# EAGLE board main (EAGLE 6.1), part 1 of 4
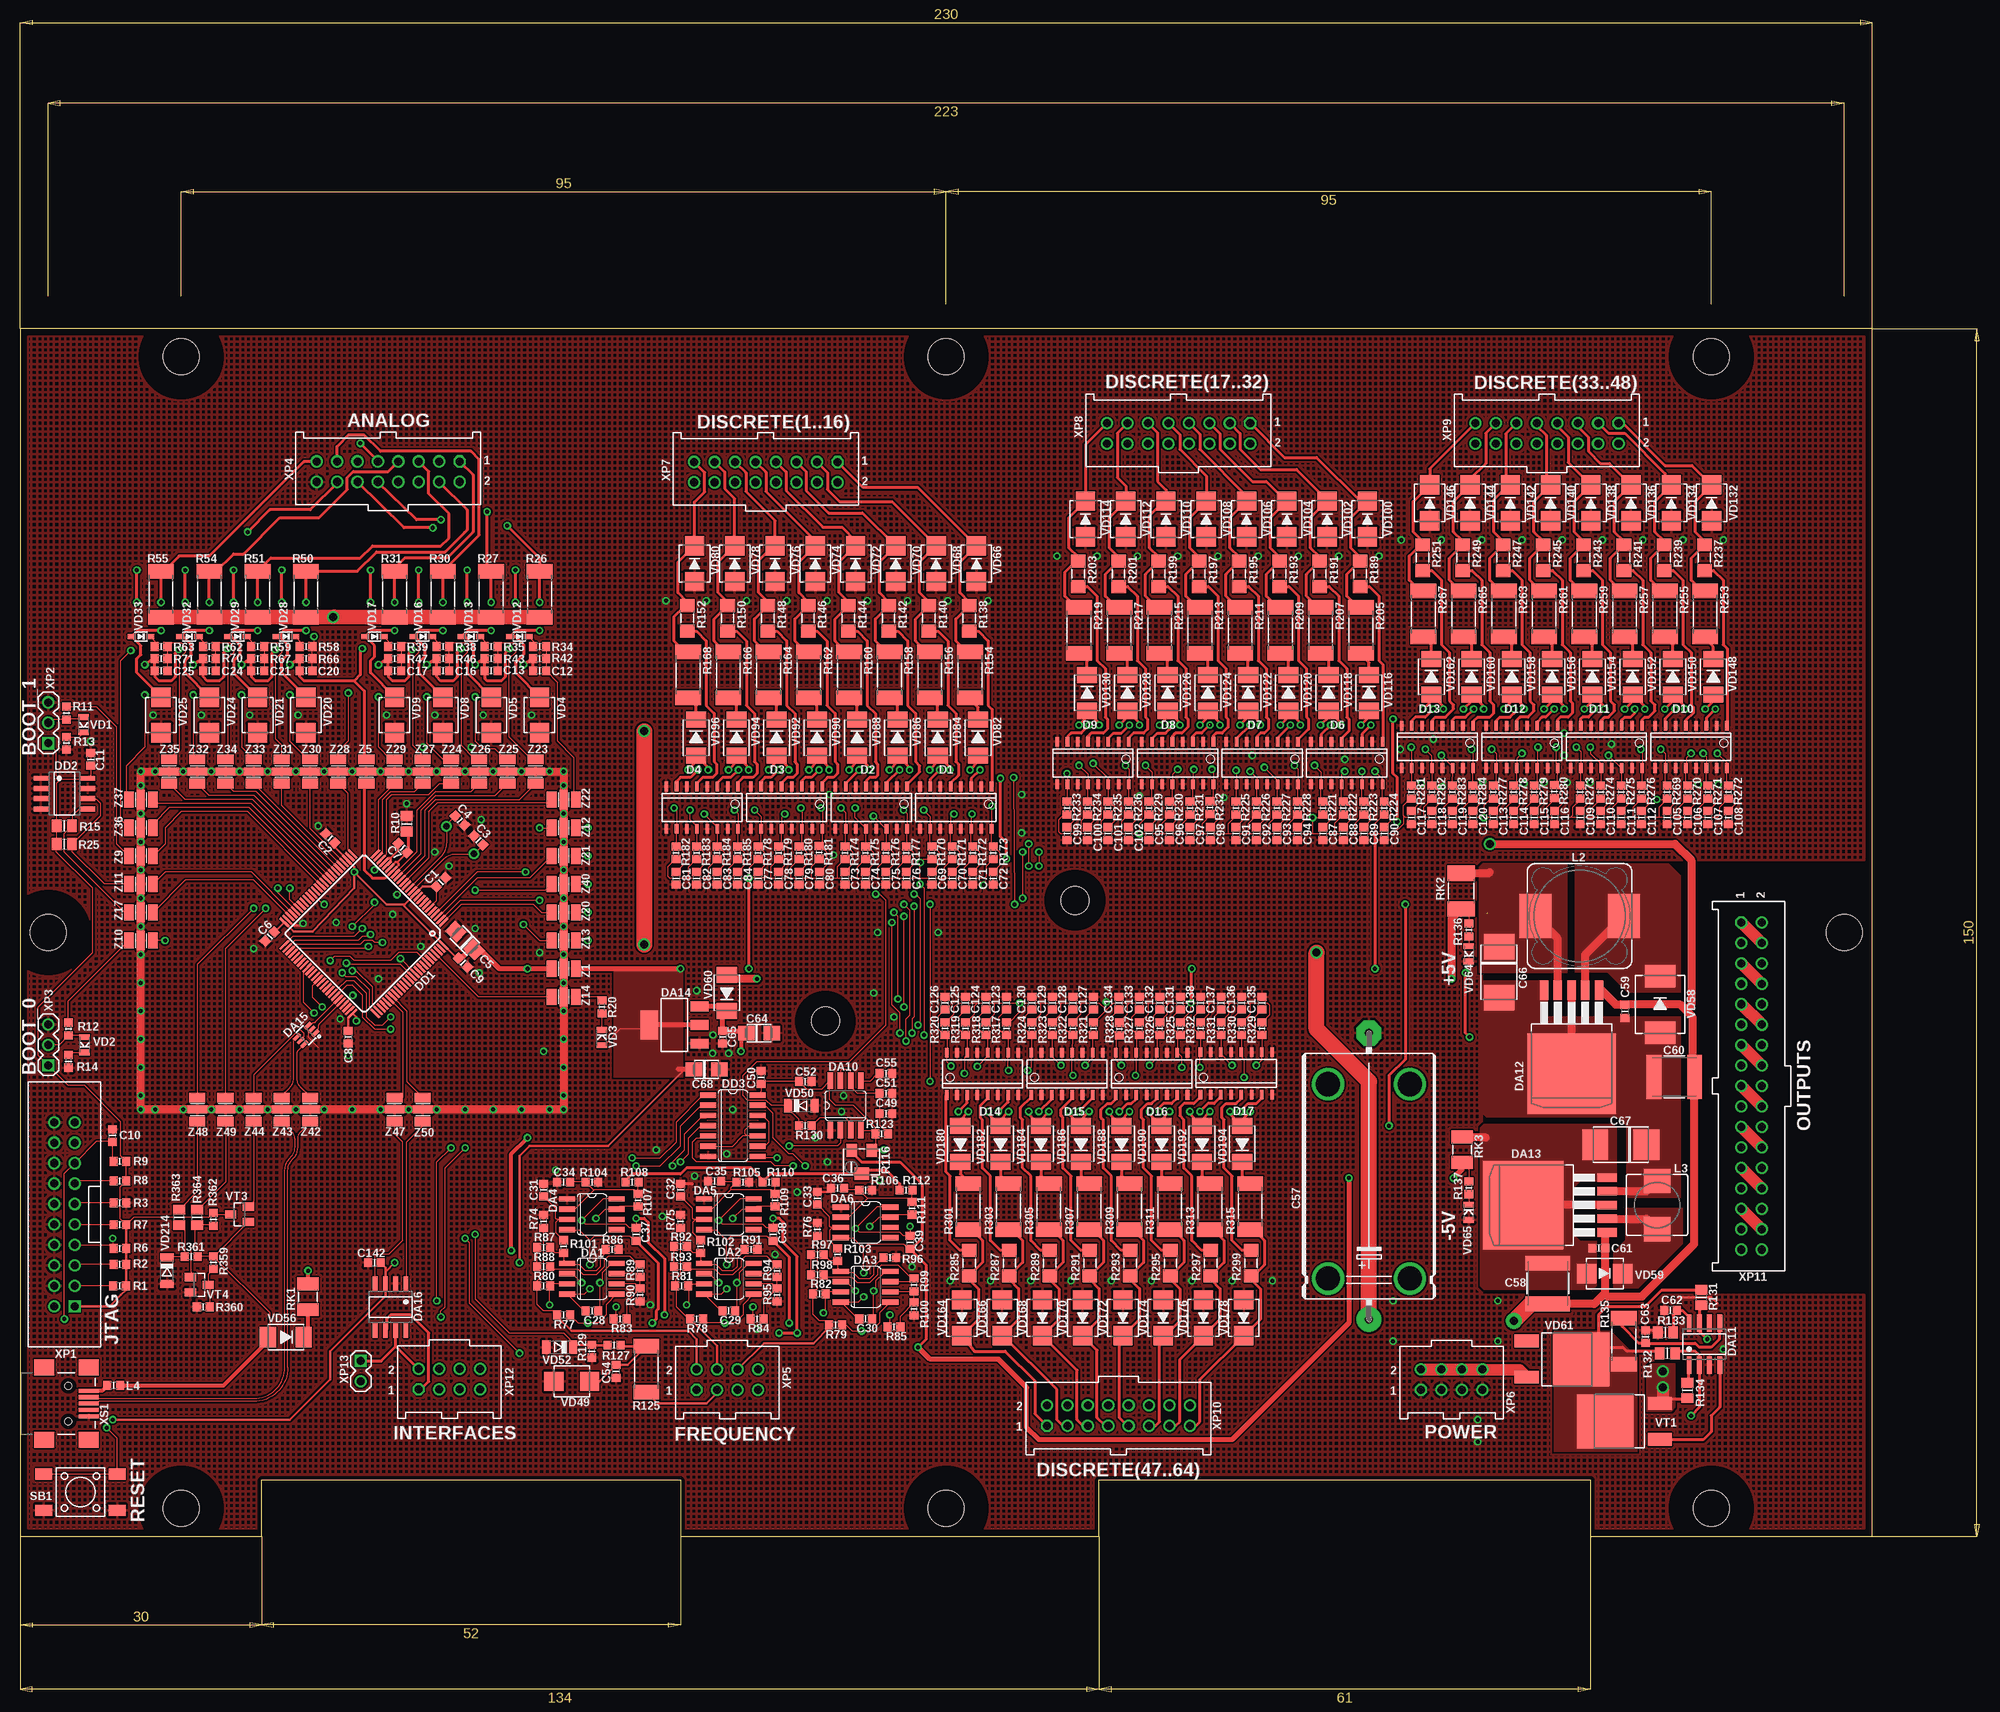
[diagram p11: board, top side]
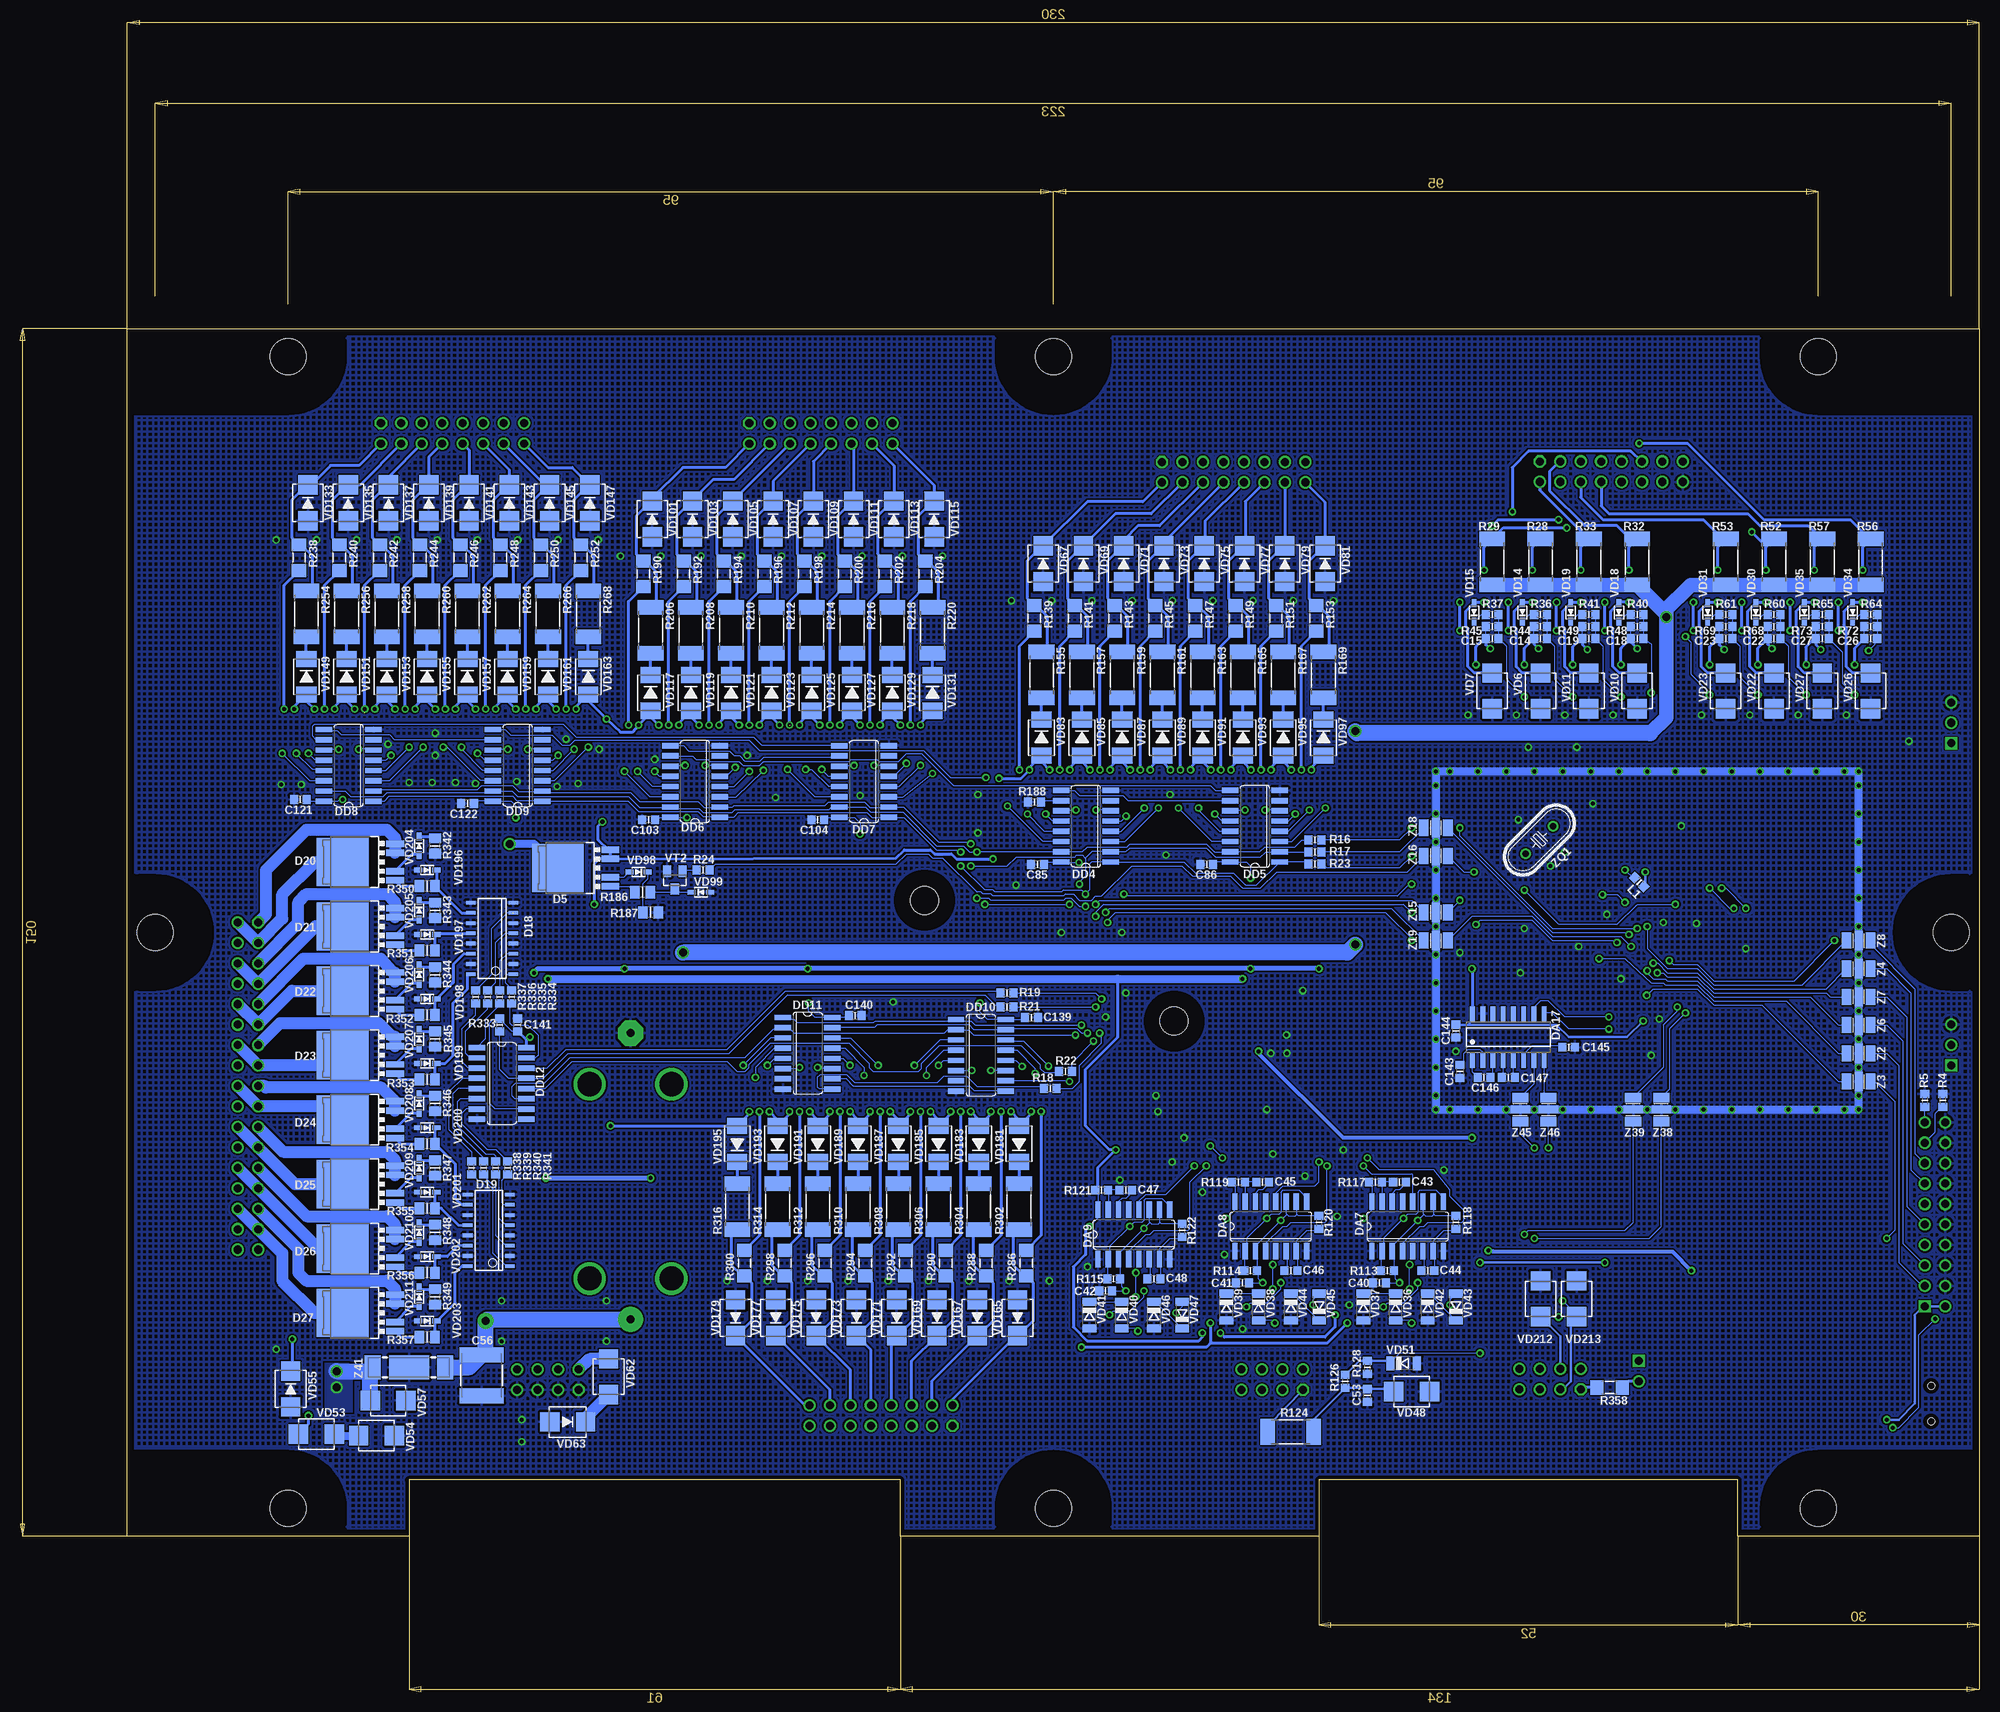
[diagram p12: board, bottom side, seen from below]

Size 230 x 150 mm. Coordinates in mm from the lower left corner, seen from the top.
Outline: 0,0 30,0 30,7 82,7 82,0 134,0 134,7 195,7 195,0 230,0 230,150 0,150 0,0
Copper layers (1*16): Top 0.035mm / dielectric 1.5mm / Bottom 0.035mm
Design rules: minimum track width 0.15mm, minimum drill 0.3mm, track to track 0.15mm, track to pad 0.15mm, pad to pad 0.15mm, via to via 0.15mm, smd to smd 0.15mm, copper to edge 0.5mm, drill to drill 0.3mm, minimum pad ring 10mil, minimum via ring 8mil, stop-mask expansion 0.05mm, vias tented up to drill 0.5mm, thermal gap 0.3mm
bRestrict: 48 lines

## Footprints (pad centres in the part's own frame; a part is rotated, then mirrored left to right if it is on the bottom)
C0603 = smd 1 x 1.1: 1 -0.794,0; 2 0.794,0
A/3216-18W = smd 2.032 x 1.778: + 1.587,0; - -1.587,0
C2220K = smd 1.85 x 5.5: 1 -2.54,0; 2 2.54,0
E35-16-STRAPPED = drill 1 pad 3.15: + -17.78,0 | drill 1 pad 3.15 octagon: - 17.78,0 | drill 3: P$1 -12.7,5.08; P$2 -12.7,-5.08; P$3 11.43,-5.08; P$4 11.43,5.08
TE-D-7343 = smd 3.175 x 3.81: + 3.175,0; - -3.175,0
SO16 = smd 0.45 x 1.2: 1 -4.381,-2.631; 2 -3.111,-2.631; 3 -1.841,-2.631; 4 -0.572,-2.631; 5 0.699,-2.631; 6 1.968,-2.631; 7 3.239,-2.631; 8 4.508,-2.631; 9 4.508,2.631; 10 3.239,2.631; 11 1.968,2.631; 12 0.699,2.631; 13 -0.572,2.631; 14 -1.841,2.631; 15 -3.111,2.631; 16 -4.381,2.631
TO252-5-11 = smd 0.8 x 2.2: 1 -2.28,-5.01; 2 -1.14,-5.01; 4 1.14,-5.01; 5 2.28,-5.01 | smd 6 x 6.4: TAB 0,1.5
SO08 = smd 0.66 x 2.032: 1 -1.905,-3.073; 2 -0.635,-3.073; 3 0.635,-3.073; 4 1.905,-3.073; 5 1.905,3.073; 6 0.635,3.073; 7 -0.635,3.073; 8 -1.905,3.073
SO16' = smd 0.66 x 2.032: 1 -4.445,-3.073; 2 -3.175,-3.073; 3 -1.905,-3.073; 4 -0.635,-3.073; 5 0.635,-3.073; 6 1.905,-3.073; 7 3.175,-3.073; 8 4.445,-3.073; 9 4.445,3.073; 10 3.175,3.073; 11 1.905,3.073; 12 0.635,3.073; 13 -0.635,3.073; 14 -1.905,3.073; 15 -3.175,3.073; 16 -4.445,3.073
SO08' = smd 0.6 x 2.2: 1 -1.905,-2.6; 2 -0.635,-2.6; 3 0.635,-2.6; 4 1.905,-2.6; 5 1.905,2.6; 6 0.635,2.6; 7 -0.635,2.6; 8 -1.905,2.6
TO263-5 = smd 1.067 x 2.413: 1 -3.404,-8.791; 2 -1.702,-8.791; 3 0,-8.791; 4 1.702,-8.791; 5 3.404,-8.791 | smd 11 x 10: 6 0,1.61
SOT223 = smd 1.219 x 2.235: 1 -2.311,-3.099; 2 0,-3.099; 3 2.311,-3.099 | smd 3.6 x 2.2: 4 0,3.099
SOTT323-6L = smd 1.05 x 0.4: 1 -1,0.65; 2 -1,0; 3 -1,-0.65; 4 0.95,-0.65; 5 0.95,0; 6 0.95,0.65
SO08'' = smd 0.6 x 1.8: 1 -1.905,-2.917; 2 -0.635,-2.917; 3 0.635,-2.917; 4 1.905,-2.917; 5 1.905,2.917; 6 0.635,2.917; 7 -0.635,2.917; 8 -1.905,2.917
SO16'' = smd 0.6 x 1.8: 1 -4.445,-2.917; 2 -3.175,-2.917; 3 -1.905,-2.917; 4 -0.635,-2.917; 5 0.635,-2.917; 6 1.905,-2.917; 7 3.175,-2.917; 8 4.445,-2.917; 9 4.445,2.917; 10 3.175,2.917; 11 1.905,2.917; 12 0.635,2.917; 13 -0.635,2.917; 14 -1.905,2.917; 15 -3.175,2.917; 16 -4.445,2.917
TQFP100 = smd 1.5 x 0.3: 1 -8,6; 2 -8,5.5; 3 -8,5; 4 -8,4.5; 5 -8,4; 6 -8,3.5; 7 -8,3; 8 -8,2.5; 9 -8,2; 10 -8,1.5; 11 -8,1; 12 -8,0.5; 13 -8,0; 14 -8,-0.5; 15 -8,-1; 16 -8,-1.5; 17 -8,-2; 18 -8,-2.5; 19 -8,-3; 20 -8,-3.5; 21 -8,-4; 22 -8,-4.5; 23 -8,-5; 24 -8,-5.5; 25 -8,-6; 51 8,-6; 52 8,-5.5; 53 8,-5; 54 8,-4.5; 55 8,-4; 56 8,-3.5; 57 8,-3; 58 8,-2.5; 59 8,-2; 60 8,-1.5; 61 8,-1; 62 8,-0.5; 63 8,0; 64 8,0.5; 65 8,1; 66 8,1.5; 67 8,2; 68 8,2.5; 69 8,3; 70 8,3.5; 71 8,4; 72 8,4.5; 73 8,5; 74 8,5.5; 75 8,6 | smd 0.3 x 1.5: 26 -6,-8; 27 -5.5,-8; 28 -5,-8; 29 -4.5,-8; 30 -4,-8; 31 -3.5,-8; 32 -3,-8; 33 -2.5,-8; 34 -2,-8; 35 -1.5,-8; 36 -1,-8; 37 -0.5,-8; 38 0,-8; 39 0.5,-8; 40 1,-8; 41 1.5,-8; 42 2,-8; 43 2.5,-8; 44 3,-8; 45 3.5,-8; 46 4,-8; 47 4.5,-8; 48 5,-8; 49 5.5,-8; 50 6,-8; 76 6,8; 77 5.5,8; 78 5,8; 79 4.5,8; 80 4,8; 81 3.5,8; 82 3,8; 83 2.5,8; 84 2,8; 85 1.5,8; 86 1,8; 87 0.5,8; 88 0,8; 89 -0.5,8; 90 -1,8; 91 -1.5,8; 92 -2,8; 93 -2.5,8; 94 -3,8; 95 -3.5,8; 96 -4,8; 97 -4.5,8; 98 -5,8; 99 -5.5,8; 100 -6,8
SO14 = smd 0.66 x 2.032: 1 -3.81,-3.073; 2 -2.54,-3.073; 3 -1.27,-3.073; 4 0,-3.073; 5 1.27,-3.073; 6 2.54,-3.073; 7 3.81,-3.073; 8 3.81,3.073; 9 2.54,3.073; 10 1.27,3.073; 11 0,3.073; 12 -1.27,3.073; 13 -2.54,3.073; 14 -3.81,3.073
STAND-OFF-M4 = hole 4.5: 0,0
STAND-OFF-M3 = hole 3.5: 0,0
L0603 = smd 1 x 1.1: 1 -0.794,0; 2 0.794,0
DRA127 = smd 4 x 5.5: 1 -5.5,0; 2 5.5,0
DRA73 = smd 3 x 3.25: 1 -3,0; 2 3,0
R0603 = smd 1 x 1.1: 1 -0.794,0; 2 0.794,0
R0805 = smd 1.2 x 1.5: 1 -0.953,0; 2 0.953,0
R2512 = smd 1.8 x 3.2: 1 -2.857,0; 2 2.857,0
RTRIMTSM53YJ = smd 1.3 x 1.6: 1 -1.25,-1.45; 3 1.25,-1.45 | smd 1.8 x 1.6: 2 0,1.45
R1206 = smd 1.6 x 1.803: 1 -1.587,0; 2 1.587,0
RK1210 = smd 1.6 x 2.7: 1 -1.587,0; 2 1.587,0
RK1812 = smd 1.9 x 3.4: 1 -2.223,0; 2 2.223,0
B3S-10XX = smd 2.1 x 1.4: 1 -4.55,2.25; 2 4.55,2.25; 3 -4.55,-2.25; 4 4.55,-2.25
LED-0805 = smd 0.7 x 1.3: A -1,0; C 0.9,0
SMB-BIDIR = smd 2.4 x 2.4: A1 -2.223,0; A2 2.223,0
SOD323 = smd 1 x 0.6: A 1.143,0; C -1.143,0
SOD80 = smd 1 x 1.7: A 1.65,0; C -1.65,0
SMB = smd 2.4 x 2.4: A 2.223,0; C -2.223,0
SMA = smd 2 x 2.5: A 2.223,0; C -2.223,0
SMC = smd 2.8 x 3.8: A 3.493,0; C -3.493,0
DPAK = smd 1.6 x 2.997: 1 -2.261,-4.928; 3 2.21,-4.928 | smd 6.7 x 7: 2 0,1.853
SOT23-BEC = smd 1 x 1.4: B -0.95,-1.1; C 0,1.1; E 0.95,-1.1
PLD_2X10_SHROUDED = drill 1 square: 1 -1.27,11.43 | drill 1: 2 1.27,11.43; 3 -1.27,8.89; 4 1.27,8.89; 5 -1.27,6.35; 6 1.27,6.35; 7 -1.27,3.81; 8 1.27,3.81; 9 -1.27,1.27; 10 1.27,1.27; 11 -1.27,-1.27; 12 1.27,-1.27; 13 -1.27,-3.81; 14 1.27,-3.81; 15 -1.27,-6.35; 16 1.27,-6.35; 17 -1.27,-8.89; 18 1.27,-8.89; 19 -1.27,-11.43; 20 1.27,-11.43
PLD_1X03 = drill 1 square: 1 0,0 | drill 1: 2 2.54,0; 3 5.08,0
MOLEX-90130-16 = drill 1 octagon: 1 0,0 | drill 1: 2 0,2.54; 3 2.54,0; 4 2.54,2.54; 5 5.08,0; 6 5.08,2.54; 7 7.62,0; 8 7.62,2.54; 9 10.16,0; 10 10.16,2.54; 11 12.7,0; 12 12.7,2.54; 13 15.24,0; 14 15.24,2.54; 15 17.78,0; 16 17.78,2.54
MOLEX-90130-08 = drill 1 octagon: 1 0,0 | drill 1: 2 0,2.54; 3 2.54,0; 4 2.54,2.54; 5 5.08,0; 6 5.08,2.54; 7 7.62,0; 8 7.62,2.54
MOLEX-90130-34 = drill 1 octagon: 1 0,0 | drill 1: 2 0,2.54; 3 2.54,0; 4 2.54,2.54; 5 5.08,0; 6 5.08,2.54; 7 7.62,0; 8 7.62,2.54; 9 10.16,0; 10 10.16,2.54; 11 12.7,0; 12 12.7,2.54; 13 15.24,0; 14 15.24,2.54; 15 17.78,0; 16 17.78,2.54; 17 20.32,0; 18 20.32,2.54; 19 22.86,0; 20 22.86,2.54; 21 25.4,0; 22 25.4,2.54; 23 27.94,0; 24 27.94,2.54; 25 30.48,0; 26 30.48,2.54; 27 33.02,0; 28 33.02,2.54; 29 35.56,0; 30 35.56,2.54; 31 38.1,0; 32 38.1,2.54; 33 40.64,0; 34 40.64,2.54
PLD_1X02 = drill 1 square: 1 0,0 | drill 1: 2 2.54,0
USB-MINIB = smd 2.5 x 0.5: D+ 2.5,0; D- 2.5,0.8; GND 2.5,-1.6; ID 2.5,-0.8; VBUS 2.5,1.6 | smd 2.5 x 2: SHIELD1 -3,4.5; SHIELD2 2.5,4.5; SHIELD3 -3,-4.5; SHIELD4 2.5,-4.5 | hole 0.9: 0,2.2; 0,-2.2
NFE31 = smd 1.2 x 2: 1 -1.5,0; 3 1.5,0 | smd 1 x 2.4: 2 0,0
TUSONIX-4701 = smd 2 x 3: 1 -4.5,0; 3 4.5,0 | smd 5 x 3: 2 0,0
HC49U-V = drill 0.8: 1 -2.413,0; 2 2.413,0

## Placement (x,y rotation side)
C1  0.1uF  [C0603]  52.25,81.25 45 top
C2  0.1uF  [C0603]  38.5,86.7 135 top
C3  22pF  [C0603]  56.93,86.43 135 top
C4  22pF  [C0603]  54.61,88.91 315 top
C5  10uF/10V  [A/3216-18W]  55.25,74 315 top
C6  0.1uF  [C0603]  31,74.5 225 top
C7  1uF/16V  [C0603]  47.5,85.5 315 top
C8  0.1uF  [C0603]  40.75,62 270 top
C9  0.1uF  [C0603]  55,71.25 315 top
C10  0.1uF  [C0603]  11.47,49.77 90 top
C11  0.1uF  [C0603]  8.75,96.5 270 top
C12  1uF/16V  [C0603]  64.5,107.5 180 top
C13  1uF/16V  [C0603]  58.5,107.5 180 top
C14  1uF/16V  [C0603]  54.5,111.5 180 bottom
C15  1uF/16V  [C0603]  60.5,111.5 180 bottom
C16  1uF/16V  [C0603]  52.5,107.5 180 top
C17  1uF/16V  [C0603]  46.5,107.5 180 top
C18  1uF/16V  [C0603]  42.5,111.5 180 bottom
C19  1uF/16V  [C0603]  48.5,111.5 180 bottom
C20  1uF/16V  [C0603]  35.5,107.5 180 top
C21  1uF/16V  [C0603]  29.5,107.5 180 top
C22  1uF/16V  [C0603]  25.5,111.5 180 bottom
C23  1uF/16V  [C0603]  31.5,111.5 180 bottom
C24  1uF/16V  [C0603]  23.5,107.5 180 top
C25  1uF/16V  [C0603]  17.5,107.5 180 top
C26  1uF/16V  [C0603]  13.5,111.5 180 bottom
C27  1uF/16V  [C0603]  19.5,111.5 180 bottom
C28  0.1uF  [C0603]  71,28 180 top
C29  0.1uF  [C0603]  88,28 180 top
C30  0.1uF  [C0603]  105,27 180 top
C31  0.1uF  [C0603]  65,43 270 top
C32  0.1uF  [C0603]  82,43 270 top
C33  0.1uF  [C0603]  99,42 270 top
C34  0.1uF  [C0603]  67.5,44 180 top
C35  0.1uF  [C0603]  86.25,44.12 180 top
C36  0.1uF  [C0603]  101.5,43.25 180 top
C37  0.1uF  [C0603]  76.5,37.5 270 top
C38  0.1uF  [C0603]  93.5,37.5 270 top
C39  0.1uF  [C0603]  110.5,36.5 270 top
C40  0.1uF  [C0603]  74.5,31.5 180 bottom
C41  0.1uF  [C0603]  91.5,31.5 180 bottom
C42  0.1uF  [C0603]  108.5,30.5 180 bottom
C43  1000pF  [C0603]  72,44 180 bottom
C44  1000pF  [C0603]  68.5,33 0 bottom
C45  1000pF  [C0603]  89,44 180 bottom
C46  1000pF  [C0603]  85.5,33 0 bottom
C47  1000pF  [C0603]  106,43 180 bottom
C48  1000pF  [C0603]  102.5,32 0 bottom
C49  5600pF  [C0603]  107.5,52.5 0 top
C50  0.1uF  [C0603]  92,57 90 top
C51  5600pF  [C0603]  107.5,55 0 top
C52  0.1uF  [C0603]  97.5,56.5 0 top
C53  0.1uF  [C0603]  76,17.5 90 bottom
C54  0.1uF  [C0603]  74,20.5 90 top
C55  0.1uF  [C0603]  107.5,57.5 0 top
C56  10uF/50V  [C2220K]  186,20 90 bottom
C57  1000uF/50v  [E35-16-STRAPPED]  167.5,44.73 90 top
C58  10uF/50V  [C2220K]  189.7,31.4 270 top
C59  0.1uF  [C0603]  199.28,65.18 270 top
C60  10uF/50V  [C2220K]  205.4,57.05 0 top
C61  0.1uF  [C0603]  196.03,35.8 180 top
C62  0.01uF  [C0603]  204.95,28.07 180 top
C63  0.1uF  [C0603]  201.85,24.81 90 top
C64  10uF/10V  [A/3216-18W]  91.75,62.5 180 top
C65  1uF/16V  [C0603]  87.25,62 270 top
C66  220uF/10V  [TE-D-7343]  183.65,70.05 90 top
C67  220uF/10V  [TE-D-7343]  198.77,48.65 0 top
C68  10uF/10V  [A/3216-18W]  85.25,58 180 top
C69  0.1uF  [C0603]  113.22,81.72 270 top
C70  0.1uF  [C0603]  115.76,81.72 270 top
C71  0.1uF  [C0603]  118.3,81.72 270 top
C72  0.1uF  [C0603]  120.84,81.72 270 top
C73  0.1uF  [C0603]  102.42,81.72 270 top
C74  0.1uF  [C0603]  104.97,81.72 270 top
C75  0.1uF  [C0603]  107.5,81.72 270 top
C76  0.1uF  [C0603]  110.05,81.72 270 top
C77  0.1uF  [C0603]  91.63,81.72 270 top
C78  0.1uF  [C0603]  94.17,81.72 270 top
C79  0.1uF  [C0603]  96.71,81.72 270 top
C80  0.1uF  [C0603]  99.25,81.72 270 top
C81  0.1uF  [C0603]  81.47,81.72 270 top
C82  0.1uF  [C0603]  84.01,81.72 270 top
C83  0.1uF  [C0603]  86.55,81.72 270 top
C84  0.1uF  [C0603]  89.09,81.72 270 top
C85  0.1uF  [C0603]  116.95,83.45 180 bottom
C86  0.1uF  [C0603]  95.95,83.45 180 bottom
C87  0.1uF  [C0603]  161.77,87.28 270 top
C88  0.1uF  [C0603]  164.31,87.28 270 top
C89  0.1uF  [C0603]  166.85,87.28 270 top
C90  0.1uF  [C0603]  169.39,87.28 270 top
C91  0.1uF  [C0603]  150.97,87.28 270 top
C92  0.1uF  [C0603]  153.51,87.28 270 top
C93  0.1uF  [C0603]  156.06,87.28 270 top
C94  0.1uF  [C0603]  158.59,87.28 270 top
C95  0.1uF  [C0603]  140.18,87.28 270 top
C96  0.1uF  [C0603]  142.72,87.28 270 top
C97  0.1uF  [C0603]  145.26,87.28 270 top
C98  0.1uF  [C0603]  147.8,87.28 270 top
C99  0.1uF  [C0603]  130.02,87.28 270 top
C100  0.1uF  [C0603]  132.56,87.28 270 top
C101  0.1uF  [C0603]  135.1,87.28 270 top
C102  0.1uF  [C0603]  137.64,87.28 270 top
C103  0.1uF  [C0603]  165.25,89 180 bottom
C104  0.1uF  [C0603]  144.25,89 180 bottom
C105  0.1uF  [C0603]  204.52,89.28 270 top
C106  0.1uF  [C0603]  207.06,89.28 270 top
C107  0.1uF  [C0603]  209.6,89.28 270 top
C108  0.1uF  [C0603]  212.14,89.28 270 top
C109  0.1uF  [C0603]  193.72,89.28 270 top
C110  0.1uF  [C0603]  196.26,89.28 270 top
C111  0.1uF  [C0603]  198.81,89.28 270 top
C112  0.1uF  [C0603]  201.34,89.28 270 top
C113  0.1uF  [C0603]  182.93,89.28 270 top
C114  0.1uF  [C0603]  185.47,89.28 270 top
C115  0.1uF  [C0603]  188.01,89.28 270 top
C116  0.1uF  [C0603]  190.55,89.28 270 top
C117  0.1uF  [C0603]  172.77,89.28 270 top
C118  0.1uF  [C0603]  175.31,89.28 270 top
C119  0.1uF  [C0603]  177.85,89.28 270 top
C120  0.1uF  [C0603]  180.39,89.28 270 top
C121  0.1uF  [C0603]  208.5,91.5 180 bottom
C122  0.1uF  [C0603]  187.75,91 180 bottom
C123  0.1uF  [C0603]  122.48,66.22 90 top
C124  0.1uF  [C0603]  119.94,66.22 90 top
C125  0.1uF  [C0603]  117.4,66.22 90 top
C126  0.1uF  [C0603]  114.86,66.22 90 top
C127  0.1uF  [C0603]  133.28,66.22 90 top
C128  0.1uF  [C0603]  130.74,66.22 90 top
C129  0.1uF  [C0603]  128.19,66.22 90 top
C130  0.1uF  [C0603]  125.66,66.22 90 top
C131  0.1uF  [C0603]  144.07,66.22 90 top
C132  0.1uF  [C0603]  141.53,66.22 90 top
C133  0.1uF  [C0603]  138.99,66.22 90 top
C134  0.1uF  [C0603]  136.45,66.22 90 top
C135  0.1uF  [C0603]  154.23,66.22 90 top
C136  0.1uF  [C0603]  151.69,66.22 90 top
C137  0.1uF  [C0603]  149.15,66.22 90 top
C138  0.1uF  [C0603]  146.61,66.22 90 top
C139  0.1uF  [C0603]  117.72,64.43 0 bottom
C140  0.1uF  [C0603]  139.59,64.69 0 bottom
C141  0.1uF  [C0603]  181.5,63.5 90 bottom
C142  0.1uF  [C0603]  44,34 0 top
C143  0.1uF  [C0603]  64.5,57.75 270 bottom
C144  0.1uF  [C0603]  65,62.75 270 bottom
C145  0.1uF  [C0603]  51,60.75 0 bottom
C146  0.1uF  [C0603]  61.5,57 0 bottom
C147  0.1uF  [C0603]  58.5,57 0 bottom
D1  TCMT4100  [SO16]  116.25,90.5 180 top
D2  TCMT4100  [SO16]  105.75,90.5 180 top
D3  TCMT4100  [SO16]  95.25,90.5 180 top
D4  TCMT4100  [SO16]  84.75,90.5 180 top
D5  AUIPS7111S  [TO252-5-11]  175,83 90 bottom
D6  TCMT4100  [SO16]  164.8,96.05 180 top
D7  TCMT4100  [SO16]  154.3,96.05 180 top
D8  TCMT4100  [SO16]  143.8,96.05 180 top
D9  TCMT4100  [SO16]  133.3,96.05 180 top
D10  TCMT4100  [SO16]  207.55,98.05 180 top
D11  TCMT4100  [SO16]  197.05,98.05 180 top
D12  TCMT4100  [SO16]  186.55,98.05 180 top
D13  TCMT4100  [SO16]  176.05,98.05 180 top
D14  TCMT4100  [SO16]  119.45,57.45 0 top
D15  TCMT4100  [SO16]  129.95,57.45 0 top
D16  TCMT4100  [SO16]  140.45,57.45 0 top
D17  TCMT4100  [SO16]  150.95,57.5 0 top
D18  TCMT4100  [SO16]  184.7,74.2 90 bottom
D19  TCMT4100  [SO16]  185.1,37.95 90 bottom
D20  AUIPS7111S  [TO252-5-11]  201.75,83.75 90 bottom
D21  AUIPS7111S  [TO252-5-11]  201.75,75.75 90 bottom
D22  AUIPS7111S  [TO252-5-11]  201.75,67.75 90 bottom
D23  AUIPS7111S  [TO252-5-11]  201.75,59.75 90 bottom
D24  AUIPS7111S  [TO252-5-11]  201.75,51.75 90 bottom
D25  AUIPS7111S  [TO252-5-11]  201.75,43.75 90 bottom
D26  AUIPS7111S  [TO252-5-11]  201.75,35.75 90 bottom
D27  AUIPS7111S  [TO252-5-11]  201.75,27.75 90 bottom
DA1  LM2904M  [SO08]  71,32 270 top
DA2  LM2904M  [SO08]  88,32 270 top
DA3  LM2904M  [SO08]  105,31 270 top
DA4  IL311AD  [SO08]  71,40 270 top
DA5  IL311AD  [SO08]  88,40 270 top
DA6  IL311AD  [SO08]  105,39 270 top
DA7  74HC123D  [SO16']  71,38.5 0 bottom
DA8  74HC123D  [SO16']  88,38.5 0 bottom
DA9  74HC123D  [SO16']  105,37.5 0 bottom
DA10  SA555D  [SO08]  102.5,53.5 0 top
DA11  MC33091A  [SO08']  209.15,23.89 0 top
DA12  LM2596S-5.0  [TO263-5]  192.65,59.05 180 top
DA13  LM2596S-5.0  [TO263-5]  188.27,41.15 90 top
DA14  IL5233G  [SOT223]  81.25,63.5 90 top
DA15  USBUF01W6  [SOTT323-6L]  35.5,62.25 225 top
DA16  SN65HVD232  [SO08'']  46,28.5 180 top
DA17  ILX3232D  [SO16'']  58.5,62 0 bottom
DD1  STM32F103VDT6  [TQFP100]  42.71,74.85 225 top
DD2  IN24AA32AD  [SO08'']  5.5,92.25 270 top
DD3  74HC11D  [SO14]  88.5,51 270 top
DD4  74HC165D  [SO16']  110.95,88.2 90 bottom
DD5  74HC165D  [SO16']  89.95,88.2 90 bottom
DD6  74HC165D  [SO16']  159.5,93.75 90 bottom
DD7  74HC165D  [SO16']  138.5,93.75 90 bottom
DD8  74HC165D  [SO16']  202.5,95.75 90 bottom
DD9  74HC165D  [SO16']  181.5,95.75 90 bottom
DD10  74HC165D  [SO16']  124,59.75 270 bottom
DD11  74HC165D  [SO16']  145.5,60 270 bottom
DD12  74HC595D  [SO16']  183.5,56.25 270 bottom
JP1  STAND-OFF-M4  [STAND-OFF-M4]  20,146.5 0 top
JP2  STAND-OFF-M4  [STAND-OFF-M4]  210,146.5 0 top
JP3  STAND-OFF-M4  [STAND-OFF-M4]  115,146.5 0 top
JP4  STAND-OFF-M4  [STAND-OFF-M4]  226.5,75 0 top
JP5  STAND-OFF-M4  [STAND-OFF-M4]  3.5,75 0 top
JP6  STAND-OFF-M4  [STAND-OFF-M4]  210,3.5 0 top
JP7  STAND-OFF-M4  [STAND-OFF-M4]  115,3.5 0 top
JP8  STAND-OFF-M4  [STAND-OFF-M4]  20,3.5 0 top
JP9  STAND-OFF-M3  [STAND-OFF-M3]  131,79 0 top
JP10  STAND-OFF-M3  [STAND-OFF-M3]  100,64 0 top
L1  EXC3BP  [L0603]  42.25,81.25 135 bottom
L2  47uH  [DRA127]  193.65,77.05 180 top
L3  100uH  [DRA73]  203.27,41.15 90 top
L4  EXC3BP  [L0603]  11.63,18.75 0 top
R1  10kOhm/1%  [R0603]  12.35,31.11 0 top
R2  10kOhm/1%  [R0603]  12.39,33.79 0 top
R3  10kOhm/1%  [R0603]  12.39,41.42 0 top
R4  10kOhm/1%  [R0603]  4.55,54.14 90 bottom
R5  10kOhm/1%  [R0603]  6.76,54.14 90 bottom
R6  10kOhm/1%  [R0603]  12.39,35.75 0 top
R7  10kOhm/1%  [R0603]  12.39,38.71 0 top
R8  10kOhm/1%  [R0603]  12.39,44.13 0 top
R9  10kOhm/1%  [R0603]  12.39,46.59 0 top
R10  0Ohm  [R0805]  48,88.5 270 top
R11  100kOhm/1%  [R0603]  5.75,102.25 270 top
R12  100kOhm/1%  [R0603]  6,63 270 top
R13  330Ohm/5%  [R0603]  5.75,98.5 90 top
R14  330Ohm/5%  [R0603]  6,59 90 top
R15  1kOhm/5%  [R0805]  5.5,88.25 0 top
R16  100Ohm/5%  [R0603]  82.5,86.5 0 bottom
R17  100Ohm/5%  [R0603]  82.5,85 0 bottom
R18  100Ohm/5%  [R0603]  115.38,55.62 0 bottom
R19  100Ohm/5%  [R0603]  120.75,67.5 0 bottom
R20  330Ohm/5%  [R0603]  72.25,65.75 270 top
R21  100Ohm/5%  [R0603]  120.75,65.75 0 bottom
R22  100Ohm/5%  [R0603]  113.5,57.75 0 bottom
R23  100Ohm/5%  [R0603]  82.5,83.5 0 bottom
R24  100Ohm/5%  [R0603]  158.5,82.75 0 bottom
R25  1kOhm/5%  [R0805]  5.5,86 0 top
R26  1kOhm/1%  [R2512]  64.5,117 90 top
R27  1kOhm/1%  [R2512]  58.5,117 90 top
R28  1kOhm/1%  [R2512]  54.5,121 90 bottom
R29  1kOhm/1%  [R2512]  60.5,121 90 bottom
R30  1kOhm/1%  [R2512]  52.5,117 90 top
R31  1kOhm/1%  [R2512]  46.5,117 90 top
R32  1kOhm/1%  [R2512]  42.5,121 90 bottom
R33  1kOhm/1%  [R2512]  48.5,121 90 bottom
R34  100kOhm/1%  [R0603]  64.5,110.5 0 top
R35  100kOhm/1%  [R0603]  58.5,110.5 0 top
R36  100kOhm/1%  [R0603]  54.5,114.5 0 bottom
R37  100kOhm/1%  [R0603]  60.5,114.5 0 bottom
R38  100kOhm/1%  [R0603]  52.5,110.5 0 top
R39  100kOhm/1%  [R0603]  46.5,110.5 0 top
R40  100kOhm/1%  [R0603]  42.5,114.5 0 bottom
R41  100kOhm/1%  [R0603]  48.5,114.5 0 bottom
R42  10kOhm/1%  [R0603]  64.5,109 0 top
R43  10kOhm/1%  [R0603]  58.5,109 0 top
R44  10kOhm/1%  [R0603]  54.5,113 0 bottom
R45  10kOhm/1%  [R0603]  60.5,113 0 bottom
R46  10kOhm/1%  [R0603]  52.5,109 0 top
R47  10kOhm/1%  [R0603]  46.5,109 0 top
R48  10kOhm/1%  [R0603]  42.5,113 0 bottom
R49  10kOhm/1%  [R0603]  48.5,113 0 bottom
R50  1kOhm/1%  [R2512]  35.5,117 90 top
R51  1kOhm/1%  [R2512]  29.5,117 90 top
R52  1kOhm/1%  [R2512]  25.5,121 90 bottom
R53  1kOhm/1%  [R2512]  31.5,121 90 bottom
R54  1kOhm/1%  [R2512]  23.5,117 90 top
R55  1kOhm/1%  [R2512]  17.5,117 90 top
R56  1kOhm/1%  [R2512]  13.5,121 90 bottom
R57  1kOhm/1%  [R2512]  19.5,121 90 bottom
R58  100kOhm/1%  [R0603]  35.5,110.5 0 top
R59  100kOhm/1%  [R0603]  29.5,110.5 0 top
R60  100kOhm/1%  [R0603]  25.5,114.5 0 bottom
R61  100kOhm/1%  [R0603]  31.5,114.5 0 bottom
R62  100kOhm/1%  [R0603]  23.5,110.5 0 top
R63  100kOhm/1%  [R0603]  17.5,110.5 0 top
R64  100kOhm/1%  [R0603]  13.5,114.5 0 bottom
R65  100kOhm/1%  [R0603]  19.5,114.5 0 bottom
R66  10kOhm/1%  [R0603]  35.5,109 0 top
R67  10kOhm/1%  [R0603]  29.5,109 0 top
R68  10kOhm/1%  [R0603]  25.5,113 0 bottom
R69  10kOhm/1%  [R0603]  31.5,113 0 bottom
R70  10kOhm/1%  [R0603]  23.5,109 0 top
R71  10kOhm/1%  [R0603]  17.5,109 0 top
R72  10kOhm/1%  [R0603]  13.5,113 0 bottom
R73  10kOhm/1%  [R0603]  19.5,113 0 bottom
R74  1.2kOhm/5%  [R0603]  65,39.12 270 top
R75  1.2kOhm/5%  [R0603]  82,39.12 270 top
R76  1.2kOhm/5%  [R0603]  99,38.12 270 top
R77  5.1kOhm/1%  [R0603]  67.5,27.5 0 top
R78  5.1kOhm/1%  [R0603]  84,27 0 top
R79  5.1kOhm/1%  [R0603]  101.25,26.25 0 top
R80  5.1kOhm/1%  [R0603]  65,31.12 0 top
R81  5.1kOhm/1%  [R0603]  82.12,31.12 0 top
R82  5.1kOhm/1%  [R0603]  99.25,30.12 0 top
R83  100kOhm/1%  [R0603]  74.5,27 180 top
R84  100kOhm/1%  [R0603]  91.5,27 180 top
R85  100kOhm/1%  [R0603]  108.5,26 180 top
R86  2.2kOhm/5%  [R0603]  73.5,35.62 0 top
R87  10kOhm/1%  [R0603]  65,35.88 0 top
R88  10kOhm/1%  [R0603]  65,33.5 180 top
R89  10kOhm/1%  [R0603]  77,33 90 top
R90  10kOhm/1%  [R0603]  77,30 90 top
R91  2.2kOhm/5%  [R0603]  90.75,35.62 0 top
R92  10kOhm/1%  [R0603]  82,36 0 top
R93  10kOhm/1%  [R0603]  82,33.5 180 top
R94  10kOhm/1%  [R0603]  94,33 90 top
R95  10kOhm/1%  [R0603]  94,30 90 top
R96  2.2kOhm/5%  [R0603]  108,34.62 0 top
R97  10kOhm/1%  [R0603]  99,35 0 top
R98  10kOhm/1%  [R0603]  99,32.5 180 top
R99  10kOhm/1%  [R0603]  111,31.25 90 top
R100  10kOhm/1%  [R0603]  111,28.25 90 top
R101  1.2kOhm/5%  [R0603]  67.5,36 90 top
R102  1.2kOhm/5%  [R0603]  84.5,36 90 top
R103  1.2kOhm/5%  [R0603]  101.5,35 90 top
R104  1.2kOhm/5%  [R0603]  71,44 0 top
R105  1.2kOhm/5%  [R0603]  89.75,44 0 top
R106  1.2kOhm/5%  [R0603]  105,43 0 top
R107  22kOhm/5%  [R0603]  76.75,41.75 270 top
R108  22kOhm/5%  [R0603]  76,44 180 top
R109  22kOhm/5%  [R0603]  93.75,41.75 270 top
R110  22kOhm/5%  [R0603]  93,44 180 top
R111  22kOhm/5%  [R0603]  110.75,40.75 270 top
R112  22kOhm/5%  [R0603]  110,43 180 top
R113  1.2kOhm/5%  [R0603]  73.5,33 180 bottom
R114  1.2kOhm/5%  [R0603]  90.5,33 180 bottom
R115  1.2kOhm/5%  [R0603]  107.5,32 180 bottom
R116  1kOhm/20%  [RTRIMTSM53YJ]  104.5,46.5 180 top
R117  51kOhm/5%  [R0603]  75,44 180 bottom
R118  51kOhm/5%  [R0603]  65,39 90 bottom
R119  51kOhm/5%  [R0603]  92,44 180 bottom
R120  51kOhm/5%  [R0603]  82,39 90 bottom
R121  51kOhm/5%  [R0603]  109,43 180 bottom
R122  51kOhm/5%  [R0603]  99,38 90 bottom
R123  51kOhm/5%  [R0603]  107,50 180 top
R124  1kOhm/5%  [R2512]  85.5,13 180 bottom
R125  1kOhm/5%  [R2512]  77.75,20.75 270 top
R126  100kOhm/1%  [R0603]  78.75,19.25 90 bottom
R127  100kOhm/1%  [R0603]  73.75,23.75 180 top
R128  36kOhm/5%  [R0603]  76,21 90 bottom
R129  36kOhm/5%  [R0603]  71,23 90 top
R130  100kOhm/1%  [R0603]  97.5,51 180 top
R131  15kOhm/5%  [R0805]  208.75,29.66 270 top
R132  82kOhm/5%  [R0805]  204.56,22.75 0 top
R133  470kOhm/5%  [R0805]  204.33,25.33 0 top
R134  1kOhm/5%  [R0805]  207.04,18.12 270 top
R135  3.3kOhm/5%  [R2512]  199.14,24.27 270 top
R136  330Ohm/5%  [R0603]  179.9,75.3 270 top
R137  330Ohm/5%  [R0603]  179.9,43.3 90 top
R138  4.7kOhm/5%  [R1206]  117.85,114 270 top
R139  4.7kOhm/5%  [R1206]  117.35,114 270 bottom
R140  4.7kOhm/5%  [R1206]  112.85,114 270 top
R141  4.7kOhm/5%  [R1206]  112.35,114 270 bottom
R142  4.7kOhm/5%  [R1206]  107.85,114 270 top
R143  4.7kOhm/5%  [R1206]  107.35,114 270 bottom
R144  4.7kOhm/5%  [R1206]  102.85,114 270 top
R145  4.7kOhm/5%  [R1206]  102.35,114 270 bottom
R146  4.7kOhm/5%  [R1206]  97.85,114 270 top
R147  4.7kOhm/5%  [R1206]  97.35,114 270 bottom
R148  4.7kOhm/5%  [R1206]  92.85,114 270 top
R149  4.7kOhm/5%  [R1206]  92.35,114 270 bottom
R150  4.7kOhm/5%  [R1206]  87.85,114 270 top
R151  4.7kOhm/5%  [R1206]  87.35,114 270 bottom
R152  4.7kOhm/5%  [R1206]  82.85,114 270 top
R153  4.7kOhm/5%  [R1206]  82.35,114 270 bottom
R154  1kOhm/5%  [R2512]  117.95,107 270 top
R155  1kOhm/5%  [R2512]  116.45,107 270 bottom
R156  1kOhm/5%  [R2512]  112.95,107 270 top
R157  1kOhm/5%  [R2512]  111.45,107 270 bottom
R158  1kOhm/5%  [R2512]  107.95,107 270 top
R159  1kOhm/5%  [R2512]  106.45,107 270 bottom
R160  1kOhm/5%  [R2512]  102.95,107 270 top
R161  1kOhm/5%  [R2512]  101.45,107 270 bottom
R162  1kOhm/5%  [R2512]  97.95,107 270 top
R163  1kOhm/5%  [R2512]  96.45,107 270 bottom
R164  1kOhm/5%  [R2512]  92.95,107 270 top
R165  1kOhm/5%  [R2512]  91.45,107 270 bottom
R166  1kOhm/5%  [R2512]  87.95,107 270 top
R167  1kOhm/5%  [R2512]  86.45,107 270 bottom
R168  1kOhm/5%  [R2512]  82.95,107 270 top
R169  1kOhm/5%  [R2512]  81.45,107 270 bottom
R170  10kOhm/1%  [R0603]  113.22,84.9 90 top
R171  10kOhm/1%  [R0603]  115.76,84.9 90 top
R172  10kOhm/1%  [R0603]  118.3,84.9 90 top
R173  10kOhm/1%  [R0603]  120.84,84.9 90 top
R174  10kOhm/1%  [R0603]  102.42,84.9 90 top
R175  10kOhm/1%  [R0603]  104.97,84.9 90 top
R176  10kOhm/1%  [R0603]  107.5,84.9 90 top
R177  10kOhm/1%  [R0603]  110.05,84.9 90 top
R178  10kOhm/1%  [R0603]  91.63,84.9 90 top
R179  10kOhm/1%  [R0603]  94.17,84.9 90 top
R180  10kOhm/1%  [R0603]  96.71,84.9 90 top
R181  10kOhm/1%  [R0603]  99.2,84.95 90 top
R182  10kOhm/1%  [R0603]  81.47,84.9 90 top
R183  10kOhm/1%  [R0603]  84.01,84.9 90 top
R184  10kOhm/1%  [R0603]  86.55,84.9 90 top
R185  10kOhm/1%  [R0603]  89.09,84.9 90 top
R186  1kOhm/5%  [R0805]  166,80 180 bottom
R187  1kOhm/5%  [R0805]  165,77.5 180 bottom
R188  10kOhm/1%  [R0603]  117.33,91.2 0 bottom
R189  4.7kOhm/5%  [R1206]  166.4,119.55 270 top
R190  4.7kOhm/5%  [R1206]  165.9,119.55 270 bottom
R191  4.7kOhm/5%  [R1206]  161.4,119.55 270 top
R192  4.7kOhm/5%  [R1206]  160.9,119.55 270 bottom
R193  4.7kOhm/5%  [R1206]  156.4,119.55 270 top
R194  4.7kOhm/5%  [R1206]  155.9,119.55 270 bottom
R195  4.7kOhm/5%  [R1206]  151.4,119.55 270 top
R196  4.7kOhm/5%  [R1206]  150.9,119.55 270 bottom
R197  4.7kOhm/5%  [R1206]  146.4,119.55 270 top
R198  4.7kOhm/5%  [R1206]  145.9,119.55 270 bottom
R199  4.7kOhm/5%  [R1206]  141.4,119.55 270 top
R200  4.7kOhm/5%  [R1206]  140.9,119.55 270 bottom
R201  4.7kOhm/5%  [R1206]  136.4,119.55 270 top
R202  4.7kOhm/5%  [R1206]  135.9,119.55 270 bottom
R203  4.7kOhm/5%  [R1206]  131.4,119.55 270 top
R204  4.7kOhm/5%  [R1206]  130.9,119.55 270 bottom
R205  1kOhm/5%  [R2512]  166.5,112.55 270 top
R206  1kOhm/5%  [R2512]  165,112.55 270 bottom
R207  1kOhm/5%  [R2512]  161.5,112.55 270 top
R208  1kOhm/5%  [R2512]  160,112.55 270 bottom
R209  1kOhm/5%  [R2512]  156.5,112.55 270 top
R210  1kOhm/5%  [R2512]  155,112.55 270 bottom
R211  1kOhm/5%  [R2512]  151.5,112.55 270 top
R212  1kOhm/5%  [R2512]  150,112.55 270 bottom
R213  1kOhm/5%  [R2512]  146.5,112.55 270 top
R214  1kOhm/5%  [R2512]  145,112.55 270 bottom
R215  1kOhm/5%  [R2512]  141.5,112.55 270 top
R216  1kOhm/5%  [R2512]  140,112.55 270 bottom
R217  1kOhm/5%  [R2512]  136.5,112.55 270 top
R218  1kOhm/5%  [R2512]  135,112.55 270 bottom
R219  1kOhm/5%  [R2512]  131.5,112.55 270 top
R220  1kOhm/5%  [R2512]  130,112.55 270 bottom
R221  10kOhm/1%  [R0603]  161.77,90.45 90 top
R222  10kOhm/1%  [R0603]  164.31,90.45 90 top
R223  10kOhm/1%  [R0603]  166.85,90.45 90 top
R224  10kOhm/1%  [R0603]  169.39,90.45 90 top
R225  10kOhm/1%  [R0603]  150.97,90.45 90 top
R226  10kOhm/1%  [R0603]  153.51,90.45 90 top
R227  10kOhm/1%  [R0603]  156.06,90.45 90 top
R228  10kOhm/1%  [R0603]  158.59,90.45 90 top
R229  10kOhm/1%  [R0603]  140.18,90.45 90 top
R230  10kOhm/1%  [R0603]  142.72,90.45 90 top
R231  10kOhm/1%  [R0603]  145.26,90.45 90 top
R232  10kOhm/1%  [R0603]  147.75,90.5 90 top
R233  10kOhm/1%  [R0603]  130.02,90.45 90 top
R234  10kOhm/1%  [R0603]  132.56,90.45 90 top
R235  10kOhm/1%  [R0603]  135.1,90.45 90 top
R236  10kOhm/1%  [R0603]  137.64,90.45 90 top
R237  4.7kOhm/5%  [R1206]  209.15,121.55 270 top
R238  4.7kOhm/5%  [R1206]  208.65,121.55 270 bottom
R239  4.7kOhm/5%  [R1206]  204.15,121.55 270 top
R240  4.7kOhm/5%  [R1206]  203.65,121.55 270 bottom
R241  4.7kOhm/5%  [R1206]  199.15,121.55 270 top
R242  4.7kOhm/5%  [R1206]  198.65,121.55 270 bottom
R243  4.7kOhm/5%  [R1206]  194.15,121.55 270 top
R244  4.7kOhm/5%  [R1206]  193.65,121.55 270 bottom
R245  4.7kOhm/5%  [R1206]  189.15,121.55 270 top
R246  4.7kOhm/5%  [R1206]  188.65,121.55 270 bottom
R247  4.7kOhm/5%  [R1206]  184.15,121.55 270 top
R248  4.7kOhm/5%  [R1206]  183.65,121.55 270 bottom
R249  4.7kOhm/5%  [R1206]  179.15,121.55 270 top
R250  4.7kOhm/5%  [R1206]  178.65,121.55 270 bottom
R251  4.7kOhm/5%  [R1206]  174.15,121.55 270 top
R252  4.7kOhm/5%  [R1206]  173.65,121.55 270 bottom
R253  1kOhm/5%  [R2512]  209.25,114.55 270 top
R254  1kOhm/5%  [R2512]  207.75,114.55 270 bottom
R255  1kOhm/5%  [R2512]  204.25,114.55 270 top
R256  1kOhm/5%  [R2512]  202.75,114.55 270 bottom
R257  1kOhm/5%  [R2512]  199.25,114.55 270 top
R258  1kOhm/5%  [R2512]  197.75,114.55 270 bottom
R259  1kOhm/5%  [R2512]  194.25,114.55 270 top
R260  1kOhm/5%  [R2512]  192.75,114.55 270 bottom
R261  1kOhm/5%  [R2512]  189.25,114.55 270 top
R262  1kOhm/5%  [R2512]  187.75,114.55 270 bottom
R263  1kOhm/5%  [R2512]  184.25,114.55 270 top
R264  1kOhm/5%  [R2512]  182.75,114.55 270 bottom
R265  1kOhm/5%  [R2512]  179.25,114.55 270 top
R266  1kOhm/5%  [R2512]  177.75,114.55 270 bottom
R267  1kOhm/5%  [R2512]  174.25,114.55 270 top
R268  1kOhm/5%  [R2512]  172.75,114.55 270 bottom
R269  10kOhm/1%  [R0603]  204.52,92.45 90 top
R270  10kOhm/1%  [R0603]  207.06,92.45 90 top
R271  10kOhm/1%  [R0603]  209.6,92.45 90 top
R272  10kOhm/1%  [R0603]  212.14,92.45 90 top
R273  10kOhm/1%  [R0603]  193.72,92.45 90 top
R274  10kOhm/1%  [R0603]  196.26,92.45 90 top
R275  10kOhm/1%  [R0603]  198.81,92.45 90 top
R276  10kOhm/1%  [R0603]  201.34,92.45 90 top
R277  10kOhm/1%  [R0603]  182.93,92.45 90 top
R278  10kOhm/1%  [R0603]  185.47,92.45 90 top
R279  10kOhm/1%  [R0603]  188.01,92.45 90 top
R280  10kOhm/1%  [R0603]  190.5,92.5 90 top
R281  10kOhm/1%  [R0603]  172.77,92.45 90 top
R282  10kOhm/1%  [R0603]  175.31,92.45 90 top
R283  10kOhm/1%  [R0603]  177.85,92.45 90 top
R284  10kOhm/1%  [R0603]  180.39,92.45 90 top
R285  4.7kOhm/5%  [R1206]  117.85,33.95 90 top
R286  4.7kOhm/5%  [R1206]  118.35,33.95 90 bottom
R287  4.7kOhm/5%  [R1206]  122.85,33.95 90 top
R288  4.7kOhm/5%  [R1206]  123.35,33.95 90 bottom
R289  4.7kOhm/5%  [R1206]  127.85,33.95 90 top
R290  4.7kOhm/5%  [R1206]  128.35,33.95 90 bottom
R291  4.7kOhm/5%  [R1206]  132.85,33.95 90 top
R292  4.7kOhm/5%  [R1206]  133.35,33.95 90 bottom
R293  4.7kOhm/5%  [R1206]  137.85,33.95 90 top
R294  4.7kOhm/5%  [R1206]  138.35,33.95 90 bottom
R295  4.7kOhm/5%  [R1206]  142.85,33.95 90 top
R296  4.7kOhm/5%  [R1206]  143.35,33.95 90 bottom
R297  4.7kOhm/5%  [R1206]  147.85,33.95 90 top
R298  4.7kOhm/5%  [R1206]  148.35,33.95 90 bottom
R299  4.7kOhm/5%  [R1206]  152.85,33.95 90 top
R300  4.7kOhm/5%  [R1206]  153.35,33.95 90 bottom
R301  1kOhm/5%  [R2512]  117.75,40.95 90 top
R302  1kOhm/5%  [R2512]  119.25,40.95 90 bottom
R303  1kOhm/5%  [R2512]  122.75,40.95 90 top
R304  1kOhm/5%  [R2512]  124.25,40.95 90 bottom
R305  1kOhm/5%  [R2512]  127.75,40.95 90 top
R306  1kOhm/5%  [R2512]  129.25,40.95 90 bottom
R307  1kOhm/5%  [R2512]  132.75,40.95 90 top
R308  1kOhm/5%  [R2512]  134.25,40.95 90 bottom
R309  1kOhm/5%  [R2512]  137.75,40.95 90 top
R310  1kOhm/5%  [R2512]  139.25,40.95 90 bottom
R311  1kOhm/5%  [R2512]  142.75,40.95 90 top
R312  1kOhm/5%  [R2512]  144.25,40.95 90 bottom
R313  1kOhm/5%  [R2512]  147.75,40.95 90 top
R314  1kOhm/5%  [R2512]  149.25,40.95 90 bottom
R315  1kOhm/5%  [R2512]  152.75,40.95 90 top
R316  1kOhm/5%  [R2512]  154.25,40.95 90 bottom
R317  10kOhm/1%  [R0603]  122.48,63.05 270 top
R318  10kOhm/1%  [R0603]  119.94,63.05 270 top
R319  10kOhm/1%  [R0603]  117.4,63.05 270 top
R320  10kOhm/1%  [R0603]  114.86,63.05 270 top
R321  10kOhm/1%  [R0603]  133.28,63.05 270 top
R322  10kOhm/1%  [R0603]  130.74,63.05 270 top
R323  10kOhm/1%  [R0603]  128.19,63.05 270 top
R324  10kOhm/1%  [R0603]  125.66,63.05 270 top
R325  10kOhm/1%  [R0603]  144.07,63.05 270 top
R326  10kOhm/1%  [R0603]  141.53,63.05 270 top
R327  10kOhm/1%  [R0603]  138.99,63.05 270 top
R328  10kOhm/1%  [R0603]  136.5,63 270 top
R329  10kOhm/1%  [R0603]  154.23,63.05 270 top
R330  10kOhm/1%  [R0603]  151.69,63.05 270 top
R331  10kOhm/1%  [R0603]  149.15,63.05 270 top
R332  10kOhm/1%  [R0603]  146.61,63.05 270 top
R333  10kOhm/1%  [R0603]  183.75,63.5 90 bottom
R334  100Ohm/5%  [R0603]  182.25,67 270 bottom
R335  100Ohm/5%  [R0603]  183.75,67 270 bottom
R336  100Ohm/5%  [R0603]  185.25,67 270 bottom
R337  100Ohm/5%  [R0603]  186.75,67 270 bottom
R338  100Ohm/5%  [R0603]  187.25,45.75 90 bottom
R339  100Ohm/5%  [R0603]  185.75,45.75 90 bottom
R340  100Ohm/5%  [R0603]  184.25,45.75 90 bottom
R341  100Ohm/5%  [R0603]  182.75,45.75 90 bottom
R342  1kOhm/5%  [R0805]  191.75,85.75 90 bottom
R343  1kOhm/5%  [R0805]  191.75,77.75 90 bottom
R344  1kOhm/5%  [R0805]  191.75,69.75 90 bottom
R345  1kOhm/5%  [R0805]  191.75,61.75 90 bottom
R346  1kOhm/5%  [R0805]  191.75,53.75 90 bottom
R347  1kOhm/5%  [R0805]  191.75,45.75 90 bottom
R348  1kOhm/5%  [R0805]  191.75,37.75 90 bottom
R349  1kOhm/5%  [R0805]  191.75,29.75 90 bottom
R350  1kOhm/5%  [R0805]  192.75,80.75 180 bottom
R351  1kOhm/5%  [R0805]  192.75,72.75 180 bottom
R352  1kOhm/5%  [R0805]  192.75,64.75 180 bottom
R353  1kOhm/5%  [R0805]  192.75,56.75 180 bottom
R354  1kOhm/5%  [R0805]  192.75,48.75 180 bottom
R355  1kOhm/5%  [R0805]  192.75,40.75 180 bottom
R356  1kOhm/5%  [R0805]  192.75,32.75 180 bottom
R357  1kOhm/5%  [R0805]  192.75,24.75 180 bottom
R358  120Ohm/5%  [R1206]  45.9,18.5 180 bottom
R359  10kOhm/1%  [R0603]  24,34 90 top
R360  36kOhm/5%  [R0603]  22.75,28.5 0 top
R361  10kOhm/1%  [R0603]  21.25,34.75 0 top
R362  47kOhm/5%  [R0603]  24,39.38 90 top
R363  1kOhm/5%  [R0805]  19.75,39.62 90 top
R364  1kOhm/5%  [R0805]  22,39.62 90 top
RK1  0.5A  [RK1210]  35.75,29.75 90 top
RK2  2A  [RK1812]  178.95,80.15 270 top
RK3  0.5A  [RK1210]  179.06,48.02 270 top
SB1  RESET  [B3S-10XX]  7.5,5.5 180 top
VD1  RED  [LED-0805]  7.88,100.75 270 top
VD2  RED  [LED-0805]  8,61 270 top
VD3  GREEN  [LED-0805]  72.25,62 90 top
VD4  SMBJ24CA  [SMB-BIDIR]  64.5,102 270 top
VD5  SMBJ24CA  [SMB-BIDIR]  58.5,102 270 top
VD6  SMBJ24CA  [SMB-BIDIR]  54.5,105 270 bottom
VD7  SMBJ24CA  [SMB-BIDIR]  60.5,105 270 bottom
VD8  SMBJ24CA  [SMB-BIDIR]  52.5,102 270 top
VD9  SMBJ24CA  [SMB-BIDIR]  46.5,102 270 top
VD10  SMBJ24CA  [SMB-BIDIR]  42.5,105 270 bottom
VD11  SMBJ24CA  [SMB-BIDIR]  48.5,105 270 bottom
VD12  40V  [SOD323]  62,111.75 180 top
VD13  40V  [SOD323]  56,111.75 180 top
VD14  40V  [SOD323]  56.75,114.75 90 bottom
VD15  40V  [SOD323]  62.75,114.75 90 bottom
VD16  40V  [SOD323]  50,111.75 180 top
VD17  40V  [SOD323]  44,111.75 180 top
VD18  40V  [SOD323]  44.75,114.75 90 bottom
VD19  40V  [SOD323]  50.75,114.75 90 bottom
VD20  SMBJ24CA  [SMB-BIDIR]  35.5,102 270 top
VD21  SMBJ24CA  [SMB-BIDIR]  29.5,102 270 top
VD22  SMBJ24CA  [SMB-BIDIR]  25.5,105 270 bottom
VD23  SMBJ24CA  [SMB-BIDIR]  31.5,105 270 bottom
VD24  SMBJ24CA  [SMB-BIDIR]  23.5,102 270 top
VD25  SMBJ24CA  [SMB-BIDIR]  17.5,102 270 top
VD26  SMBJ24CA  [SMB-BIDIR]  13.5,105 270 bottom
VD27  SMBJ24CA  [SMB-BIDIR]  19.5,105 270 bottom
VD28  40V  [SOD323]  33,111.75 180 top
VD29  40V  [SOD323]  27,111.75 180 top
VD30  40V  [SOD323]  27.75,114.75 90 bottom
VD31  40V  [SOD323]  33.75,114.75 90 bottom
VD32  40V  [SOD323]  21,111.75 180 top
VD33  40V  [SOD323]  15,111.75 180 top
VD34  40V  [SOD323]  15.75,114.75 90 bottom
VD35  40V  [SOD323]  21.75,114.75 90 bottom
VD36  3.3V  [SOD80]  72.5,28.5 270 bottom
VD37  3.3V  [SOD80]  76.5,28.5 270 bottom
VD38  3.3V  [SOD80]  89.5,28.5 270 bottom
VD39  3.3V  [SOD80]  93.5,28.5 270 bottom
VD40  3.3V  [SOD80]  106.5,27.5 270 bottom
VD41  3.3V  [SOD80]  110.5,27.5 270 bottom
VD42  3.3V  [SOD80]  68.5,28.5 270 bottom
VD43  3.3V  [SOD80]  65,28.5 90 bottom
VD44  3.3V  [SOD80]  85.5,28.5 270 bottom
VD45  3.3V  [SOD80]  82,28.5 90 bottom
VD46  3.3V  [SOD80]  102.5,27.5 270 bottom
VD47  3.3V  [SOD80]  99,27.5 90 bottom
VD48  SMBJ24CA  [SMB-BIDIR]  70.5,18 0 bottom
VD49  SMBJ24CA  [SMB-BIDIR]  68.5,19.25 180 top
VD50  3.3V  [SOD80]  97,53.5 0 top
VD51  3.3V  [SOD80]  71.5,21.5 0 bottom
VD52  3.3V  [SOD80]  67,23.5 180 top
VD53  SMBJ24CA  [SMB-BIDIR]  206.51,12.71 180 bottom
VD54  SMBJ24CA  [SMB-BIDIR]  199.04,12.52 180 bottom
VD55  SM6T6V8A  [SMB]  209.7,18.32 270 bottom
VD56  400V  [SMA]  33,24.75 180 top
VD57  SMBJ24CA  [SMB-BIDIR]  197.6,16.88 0 bottom
VD58  3A/60V  [SMC]  203.65,66.05 270 top
VD59  1A/60V  [SMB]  196.77,32.65 180 top
VD60  400V  [SMA]  87.75,67.5 90 top
VD61  600V/6A  [DPAK]  192,22 270 top
VD62  SMBJ24CA  [SMB-BIDIR]  170.22,19.82 270 bottom
VD63  SM6T200A  [SMB]  175.3,14.22 180 bottom
VD64  GREEN  [LED-0805]  179.9,72.3 270 top
VD65  GREEN  [LED-0805]  179.9,40.3 90 top
VD66  SM6T200A  [SMB]  118.75,120.8 270 top
VD67  SM6T200A  [SMB]  116.25,120.8 270 bottom
VD68  SM6T200A  [SMB]  113.75,120.8 270 top
VD69  SM6T200A  [SMB]  111.25,120.8 270 bottom
VD70  SM6T200A  [SMB]  108.75,120.8 270 top
VD71  SM6T200A  [SMB]  106.25,120.8 270 bottom
VD72  SM6T200A  [SMB]  103.75,120.8 270 top
VD73  SM6T200A  [SMB]  101.25,120.8 270 bottom
VD74  SM6T200A  [SMB]  98.75,120.8 270 top
VD75  SM6T200A  [SMB]  96.25,120.8 270 bottom
VD76  SM6T200A  [SMB]  93.75,120.8 270 top
VD77  SM6T200A  [SMB]  91.25,120.8 270 bottom
VD78  SM6T200A  [SMB]  88.75,120.8 270 top
VD79  SM6T200A  [SMB]  86.25,120.8 270 bottom
VD80  SM6T200A  [SMB]  83.75,120.8 270 top
VD81  SM6T200A  [SMB]  81.25,120.8 270 bottom
VD82  400V  [SMA]  118.95,99.2 270 top
VD83  400V  [SMA]  116.45,99.2 270 bottom
VD84  400V  [SMA]  113.95,99.2 270 top
VD85  400V  [SMA]  111.45,99.2 270 bottom
VD86  400V  [SMA]  108.95,99.2 270 top
VD87  400V  [SMA]  106.45,99.2 270 bottom
VD88  400V  [SMA]  103.95,99.2 270 top
VD89  400V  [SMA]  101.45,99.2 270 bottom
VD90  400V  [SMA]  98.95,99.2 270 top
VD91  400V  [SMA]  96.45,99.2 270 bottom
VD92  400V  [SMA]  93.95,99.2 270 top
VD93  400V  [SMA]  91.45,99.2 270 bottom
VD94  400V  [SMA]  88.95,99.2 270 top
VD95  400V  [SMA]  86.45,99.2 270 bottom
VD96  400V  [SMA]  83.95,99.2 270 top
VD97  400V  [SMA]  81.45,99.2 270 bottom
VD98  100V  [SOD323]  166.5,82.5 180 bottom
VD99  100V  [SOD323]  158.75,80 0 bottom
VD100  SM6T200A  [SMB]  167.3,126.35 270 top
VD101  SM6T200A  [SMB]  164.8,126.35 270 bottom
VD102  SM6T200A  [SMB]  162.3,126.35 270 top
VD103  SM6T200A  [SMB]  159.8,126.35 270 bottom
VD104  SM6T200A  [SMB]  157.3,126.35 270 top
VD105  SM6T200A  [SMB]  154.8,126.35 270 bottom
VD106  SM6T200A  [SMB]  152.3,126.35 270 top
VD107  SM6T200A  [SMB]  149.8,126.35 270 bottom
VD108  SM6T200A  [SMB]  147.3,126.35 270 top
VD109  SM6T200A  [SMB]  144.8,126.35 270 bottom
VD110  SM6T200A  [SMB]  142.3,126.35 270 top
VD111  SM6T200A  [SMB]  139.8,126.35 270 bottom
VD112  SM6T200A  [SMB]  137.3,126.35 270 top
VD113  SM6T200A  [SMB]  134.8,126.35 270 bottom
VD114  SM6T200A  [SMB]  132.3,126.35 270 top
VD115  SM6T200A  [SMB]  129.8,126.35 270 bottom
VD116  400V  [SMA]  167.5,104.75 270 top
VD117  400V  [SMA]  165,104.75 270 bottom
VD118  400V  [SMA]  162.5,104.75 270 top
VD119  400V  [SMA]  160,104.75 270 bottom
VD120  400V  [SMA]  157.5,104.75 270 top
VD121  400V  [SMA]  155,104.75 270 bottom
VD122  400V  [SMA]  152.5,104.75 270 top
VD123  400V  [SMA]  150,104.75 270 bottom
VD124  400V  [SMA]  147.5,104.75 270 top
VD125  400V  [SMA]  145,104.75 270 bottom
VD126  400V  [SMA]  142.5,104.75 270 top
VD127  400V  [SMA]  140,104.75 270 bottom
VD128  400V  [SMA]  137.5,104.75 270 top
VD129  400V  [SMA]  135,104.75 270 bottom
VD130  400V  [SMA]  132.5,104.75 270 top
VD131  400V  [SMA]  130,104.75 270 bottom
VD132  SM6T200A  [SMB]  210.05,128.35 270 top
VD133  SM6T200A  [SMB]  207.55,128.35 270 bottom
VD134  SM6T200A  [SMB]  205.05,128.35 270 top
VD135  SM6T200A  [SMB]  202.55,128.35 270 bottom
VD136  SM6T200A  [SMB]  200.05,128.35 270 top
VD137  SM6T200A  [SMB]  197.55,128.35 270 bottom
VD138  SM6T200A  [SMB]  195.05,128.35 270 top
VD139  SM6T200A  [SMB]  192.55,128.35 270 bottom
VD140  SM6T200A  [SMB]  190.05,128.35 270 top
VD141  SM6T200A  [SMB]  187.55,128.35 270 bottom
VD142  SM6T200A  [SMB]  185.05,128.35 270 top
VD143  SM6T200A  [SMB]  182.55,128.35 270 bottom
VD144  SM6T200A  [SMB]  180.05,128.35 270 top
VD145  SM6T200A  [SMB]  177.55,128.35 270 bottom
VD146  SM6T200A  [SMB]  175.05,128.35 270 top
VD147  SM6T200A  [SMB]  172.55,128.35 270 bottom
VD148  400V  [SMA]  210.25,106.75 270 top
VD149  400V  [SMA]  207.75,106.75 270 bottom
VD150  400V  [SMA]  205.25,106.75 270 top
VD151  400V  [SMA]  202.75,106.75 270 bottom
VD152  400V  [SMA]  200.25,106.75 270 top
VD153  400V  [SMA]  197.75,106.75 270 bottom
VD154  400V  [SMA]  195.25,106.75 270 top
VD155  400V  [SMA]  192.75,106.75 270 bottom
VD156  400V  [SMA]  190.25,106.75 270 top
VD157  400V  [SMA]  187.75,106.75 270 bottom
VD158  400V  [SMA]  185.25,106.75 270 top
VD159  400V  [SMA]  182.75,106.75 270 bottom
VD160  400V  [SMA]  180.25,106.75 270 top
VD161  400V  [SMA]  177.75,106.75 270 bottom
VD162  400V  [SMA]  175.25,106.75 270 top
VD163  400V  [SMA]  172.75,106.75 270 bottom
VD164  SM6T200A  [SMB]  116.95,27.15 90 top
VD165  SM6T200A  [SMB]  119.45,27.15 90 bottom
VD166  SM6T200A  [SMB]  121.95,27.15 90 top
VD167  SM6T200A  [SMB]  124.45,27.15 90 bottom
VD168  SM6T200A  [SMB]  126.95,27.15 90 top
VD169  SM6T200A  [SMB]  129.45,27.15 90 bottom
VD170  SM6T200A  [SMB]  131.95,27.15 90 top
VD171  SM6T200A  [SMB]  134.45,27.15 90 bottom
VD172  SM6T200A  [SMB]  136.95,27.15 90 top
VD173  SM6T200A  [SMB]  139.45,27.15 90 bottom
VD174  SM6T200A  [SMB]  141.95,27.15 90 top
VD175  SM6T200A  [SMB]  144.45,27.15 90 bottom
VD176  SM6T200A  [SMB]  146.95,27.15 90 top
VD177  SM6T200A  [SMB]  149.45,27.15 90 bottom
VD178  SM6T200A  [SMB]  151.95,27.15 90 top
VD179  SM6T200A  [SMB]  154.45,27.15 90 bottom
VD180  400V  [SMA]  116.75,48.75 90 top
VD181  400V  [SMA]  119.25,48.75 90 bottom
VD182  400V  [SMA]  121.75,48.75 90 top
VD183  400V  [SMA]  124.25,48.75 90 bottom
VD184  400V  [SMA]  126.75,48.75 90 top
VD185  400V  [SMA]  129.25,48.75 90 bottom
VD186  400V  [SMA]  131.75,48.75 90 top
VD187  400V  [SMA]  134.25,48.75 90 bottom
VD188  400V  [SMA]  136.75,48.75 90 top
VD189  400V  [SMA]  139.25,48.75 90 bottom
VD190  400V  [SMA]  141.75,48.75 90 top
VD191  400V  [SMA]  144.25,48.75 90 bottom
VD192  400V  [SMA]  146.75,48.75 90 top
VD193  400V  [SMA]  149.25,48.75 90 bottom
VD194  400V  [SMA]  151.75,48.75 90 top
VD195  400V  [SMA]  154.25,48.75 90 bottom
VD196  100V  [SOD323]  192.75,82.75 180 bottom
VD197  100V  [SOD323]  192.75,74.75 180 bottom
VD198  100V  [SOD323]  192.75,66.75 180 bottom
VD199  100V  [SOD323]  192.75,58.75 180 bottom
VD200  100V  [SOD323]  192.75,50.75 180 bottom
VD201  100V  [SOD323]  192.75,42.75 180 bottom
VD202  100V  [SOD323]  192.75,34.75 180 bottom
VD203  100V  [SOD323]  192.75,26.75 180 bottom
VD204  100V  [SOD323]  193.75,85.75 270 bottom
VD205  100V  [SOD323]  193.75,77.75 270 bottom
VD206  100V  [SOD323]  193.75,69.75 270 bottom
VD207  100V  [SOD323]  193.75,61.75 270 bottom
VD208  100V  [SOD323]  193.75,53.75 270 bottom
VD209  100V  [SOD323]  193.75,45.75 270 bottom
VD210  100V  [SOD323]  193.75,37.75 270 bottom
VD211  100V  [SOD323]  193.75,29.75 270 bottom
VD212  SMBJ24CA  [SMB-BIDIR]  54.5,29.5 270 bottom
VD213  SMBJ24CA  [SMB-BIDIR]  50,29.5 270 bottom
VD214  3.3V  [SOD80]  18.25,33 270 top
VT1  IRFR430  [DPAK]  198.69,14.31 90 top
VT2  BC817-16SMD  [SOT23-BEC]  162,81.5 180 bottom
VT3  BC817-16SMD  [SOT23-BEC]  27.25,40 90 top
VT4  BC817-16SMD  [SOT23-BEC]  22.25,31.25 270 top
XP1  [PLD_2X10_SHROUDED]  5.5,40 180 top
XP2  PLD_1X3  [PLD_1X03]  3.5,98.5 90 top
XP3  PLD_1X3  [PLD_1X03]  3.5,58.5 90 top
XP4  [MOLEX-90130-16]  54.59,133.5 180 top
XP5  [MOLEX-90130-08]  84.01,18.21 0 top
XP6  [MOLEX-90130-08]  173.95,18.19 0 top
XP7  [MOLEX-90130-16]  101.49,133.44 180 top
XP8  [MOLEX-90130-16]  152.75,138.25 180 top
XP9  [MOLEX-90130-16]  198.5,138.25 180 top
XP10  [MOLEX-90130-16]  127.5,13.75 0 top
XP11  [MOLEX-90130-34]  213.75,76.25 270 top
XP12  [MOLEX-90130-08]  49.5,18.25 0 top
XP13  PLD_1X02  [PLD_1X02]  42.3,21.8 270 top
XS1  [USB-MINIB]  6,16.5 0 top
Z1  NFE31PT  [NFE31]  67.5,70.5 0 top
Z2  NFE31PT  [NFE31]  15,60 0 bottom
Z3  NFE31PT  [NFE31]  15,56.5 0 bottom
Z4  NFE31PT  [NFE31]  15,70.5 0 bottom
Z5  NFE31PT  [NFE31]  43,95 270 top
Z6  NFE31PT  [NFE31]  15,63.5 0 bottom
Z7  NFE31PT  [NFE31]  15,67 0 bottom
Z8  NFE31PT  [NFE31]  15,74 0 bottom
Z9  NFE31PT  [NFE31]  15,84.5 0 top
Z10  NFE31PT  [NFE31]  15,74 0 top
Z11  NFE31PT  [NFE31]  15,81 0 top
Z12  NFE31PT  [NFE31]  67.5,88 0 top
Z13  NFE31PT  [NFE31]  67.5,74 0 top
Z14  NFE31PT  [NFE31]  67.5,67 0 top
Z15  NFE31PT  [NFE31]  67.5,77.5 180 bottom
Z16  NFE31PT  [NFE31]  67.5,84.5 180 bottom
Z17  NFE31PT  [NFE31]  15,77.5 0 top
Z18  NFE31PT  [NFE31]  67.5,88 180 bottom
Z19  NFE31PT  [NFE31]  67.5,74 180 bottom
Z20  NFE31PT  [NFE31]  67.5,77.5 0 top
Z21  NFE31PT  [NFE31]  67.5,84.5 0 top
Z22  NFE31PT  [NFE31]  67.5,91.5 180 top
Z23  NFE31PT  [NFE31]  64,95 270 top
Z24  NFE31PT  [NFE31]  53.5,95 270 top
Z25  NFE31PT  [NFE31]  60.5,95 270 top
Z26  NFE31PT  [NFE31]  57,95 270 top
Z27  NFE31PT  [NFE31]  50,95 270 top
Z28  NFE31PT  [NFE31]  39.5,95 270 top
Z29  NFE31PT  [NFE31]  46.5,95 270 top
Z30  NFE31PT  [NFE31]  36,95 270 top
Z31  NFE31PT  [NFE31]  32.5,95 270 top
Z32  NFE31PT  [NFE31]  22,95 270 top
Z33  NFE31PT  [NFE31]  29,95 270 top
Z34  NFE31PT  [NFE31]  25.5,95 270 top
Z35  NFE31PT  [NFE31]  18.5,95 270 top
Z36  NFE31PT  [NFE31]  15,88 0 top
Z37  NFE31PT  [NFE31]  15,91.5 0 top
Z38  NFE31PT  [NFE31]  39.5,53 90 bottom
Z39  NFE31PT  [NFE31]  43,53 90 bottom
Z40  NFE31PT  [NFE31]  67.5,81 180 top
Z41  4701-001LF  [TUSONIX-4701]  195,21 0 bottom
Z42  NFE31PT  [NFE31]  36,53 270 top
Z43  NFE31PT  [NFE31]  32.5,53 270 top
Z44  NFE31PT  [NFE31]  29,53 270 top
Z45  NFE31PT  [NFE31]  57,53 90 bottom
Z46  NFE31PT  [NFE31]  53.5,53 90 bottom
Z47  NFE31PT  [NFE31]  46.5,53 90 top
Z48  NFE31PT  [NFE31]  22,53 90 top
Z49  NFE31PT  [NFE31]  25.5,53 90 top
Z50  NFE31PT  [NFE31]  50,53 90 top
ZQ1  4MHz  [HC49U-V]  54.63,86.48 225 bottom

## Tracks (layer width: path | path; a pad name or v marks a point on that pad's centre or on a via)
!SR_OUT_ENABLE
  Bottom 0.15: R21.1 121.5,65.75 121.75,66 122.25,66 123.5,67.25 148,67.25 155.25,60 175.25,60 178.37,56.88 DD12.13 182.63,56.88 183.75,58 R333.1 183.75,62.75
!SR_SAMPLE  (via drill 0.5)
  Top 0.15: v111.5,63.5 111.75,63.75 111.75,79.25 111.25,79.75 v111,79.75 | v126.5,85 v126.5,83.25
  Bottom 0.15: DD11.1 148.38,64.25 147.25,64.25 146.8,63.8 137.3,63.8 137.1,64 128,64 127.81,64.19 DD10.1 126.88,64 125.25,64 124.75,63.5 v111.5,63.5 | DD8.1 198.06,91.31 197.45,91.92 182.16,91.92 181.62,91.38 178.62,91.38 178.5,91.25 178.44,91.31 DD9.1 167.81,91.31 166.5,90 159.12,90 158.5,89.38 156.5,89.38 DD6.1 154.69,89.31 154.12,89.88 138.12,89.88 137.5,89.25 135.48,89.25 DD7.1 133.56,89.31 129.5,85.25 126.75,85.25 v126.5,85 | R23.1 83.55,83.75 DD5.1 89.76,80.88 91.12,80.88 92.62,82.38 97.38,82.38 98.75,83.75 DD4.1 110.25,83.75 110.5,83.5 110.5,80.25 v111,79.75 111.5,80.25 113.75,80.25 114,80 122.25,80 122.5,80.25 123.5,80.25 v126.5,83.25
+3V3  (via drill 0.5)
  Top 0.15: R320.1 114.97,63.84 116,64.88 116,65.75 116.5,66.25 118.88,66.25 | 118.88,66.25 121.12,66.25 | 121.12,66.25 v124.12,66.25 | v124.12,66.25 126.75,66.25 | 126.75,66.25 129.38,66.25 | 129.38,66.25 131.88,66.25 | 131.88,66.25 134,66.25 134.75,65.5 135,65.5 | 137.75,66.25 135.75,66.25 135,65.5 | 137.75,66.25 140.25,66.25 | 140.25,66.25 142.75,66.25 | 142.75,66.25 145.25,66.25 | 145.25,66.25 v145.4,66.25 147.88,66.25 | 147.88,66.25 150.38,66.25 | 150.38,66.25 152.75,66.25 | 152.75,66.25 154.88,66.25 155.12,66 155.12,64.74 R329.1 | R319.1 117.47,63.84 118.5,64.88 118.5,65.88 118.88,66.25 | R318.1 119.97,63.84 121,64.88 121,66.12 121.12,66.25 | R317.1 122.84,63.84 124.12,65.12 v124.12,66.25 | R324.1 125.72,63.84 126.75,64.88 126.75,66.25 | R323.1 128.22,63.84 129.25,64.88 129.25,66.12 129.38,66.25 | R322.1 130.74,63.86 131.75,64.88 131.75,66.12 131.88,66.25 | R321.1 133.34,63.84 135,65.5 | R328.1 136.5,63.88 137.5,64.88 137.5,66 137.75,66.25 | R327.1 139.09,63.84 140.12,64.88 140.12,66.12 140.25,66.25 | R326.1 141.53,63.91 142.5,64.88 142.5,66 142.75,66.25 | R325.1 144.07,63.95 145.4,65.28 145.4,66.1 145.25,66.25 | R332.1 146.61,63.86 147.62,64.88 147.62,66 147.88,66.25 | R331.1 149.15,63.9 150.12,64.88 150.12,66 150.38,66.25 | R330.1 151.72,63.84 152.75,64.88 152.75,66.25 | R272.1 212.14,91.64 211,90.5 211,89.5 210.75,89.25 208.5,89.25 | 208.5,89.25 206,89.25 | 206,89.25 203.5,89.25 | 203.5,89.25 200.25,89.25 | 200.25,89.25 197.75,89.25 | 197.75,89.25 195.25,89.25 | 195.25,89.25 192.5,89.25 | 192.5,89.25 189.5,89.25 | 189.5,89.25 187,89.25 | 187,89.25 184.5,89.25 | 184.5,89.25 v181.75,89.25 | v181.75,89.25 179.25,89.25